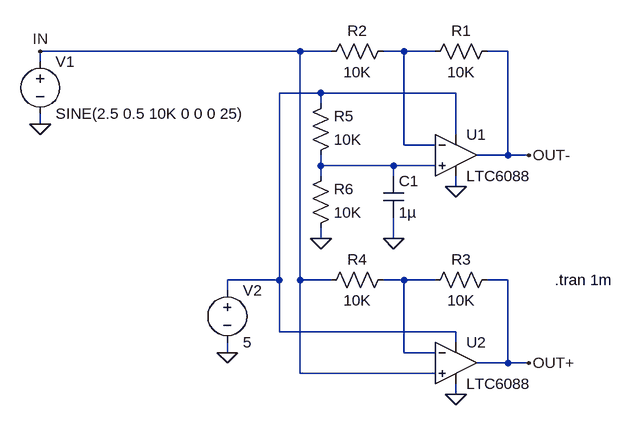
[diagram p0: schematic 6088.asc]
6088.asc, the LTspice schematic file:
Version 4
SHEET 1 912 700
WIRE -112 -880 -512 -880
WIRE -64 -880 -112 -880
WIRE 48 -880 16 -880
WIRE 96 -880 48 -880
WIRE 208 -880 176 -880
WIRE -512 -864 -512 -880
WIRE -80 -816 -144 -816
WIRE 128 -816 -80 -816
WIRE -80 -800 -80 -816
WIRE -512 -768 -512 -784
WIRE 128 -752 128 -816
WIRE 48 -736 48 -880
WIRE 96 -736 48 -736
WIRE 208 -720 208 -880
WIRE 208 -720 160 -720
WIRE 240 -720 208 -720
WIRE -80 -704 -80 -720
WIRE 32 -704 -80 -704
WIRE 96 -704 32 -704
WIRE -80 -688 -80 -704
WIRE 32 -688 32 -704
WIRE 128 -672 128 -688
WIRE -80 -592 -80 -608
WIRE 32 -592 32 -624
WIRE -144 -528 -144 -816
WIRE -144 -528 -224 -528
WIRE -112 -528 -112 -880
WIRE -64 -528 -112 -528
WIRE 48 -528 16 -528
WIRE 96 -528 48 -528
WIRE 208 -528 176 -528
WIRE -224 -512 -224 -528
WIRE -144 -448 -144 -528
WIRE 128 -448 -144 -448
WIRE 128 -432 128 -448
WIRE -224 -416 -224 -432
WIRE 48 -416 48 -528
WIRE 96 -416 48 -416
WIRE 208 -400 208 -528
WIRE 208 -400 160 -400
WIRE 240 -400 208 -400
WIRE -112 -384 -112 -528
WIRE 96 -384 -112 -384
WIRE 128 -352 128 -368
FLAG -512 -768 0
FLAG -512 -880 IN
FLAG 240 -720 OUT-
FLAG 240 -400 OUT+
FLAG -224 -416 0
FLAG 128 -672 0
FLAG 128 -352 0
FLAG 32 -592 0
FLAG -80 -592 0
SYMBOL voltage -512 -880 R0
WINDOW 123 24 146 Left 2
WINDOW 39 24 125 Left 2
SYMATTR InstName V1
SYMATTR Value SINE(2.5 0.5 10K 0 0 0 25)
SYMBOL voltage -224 -528 R0
SYMATTR InstName V2
SYMATTR Value 5
SYMBOL res 192 -896 R90
WINDOW 0 0 56 VBottom 2
WINDOW 3 32 56 VTop 2
SYMATTR InstName R1
SYMATTR Value 10K
SYMBOL res 32 -896 R90
WINDOW 0 0 56 VBottom 2
WINDOW 3 32 56 VTop 2
SYMATTR InstName R2
SYMATTR Value 10K
SYMBOL LTC6088 128 -720 R0
SYMATTR InstName U1
SYMBOL res 192 -544 R90
WINDOW 0 0 56 VBottom 2
WINDOW 3 32 56 VTop 2
SYMATTR InstName R3
SYMATTR Value 10K
SYMBOL res 32 -544 R90
WINDOW 0 0 56 VBottom 2
WINDOW 3 32 56 VTop 2
SYMATTR InstName R4
SYMATTR Value 10K
SYMBOL LTC6088 128 -400 R0
SYMATTR InstName U2
SYMBOL res -96 -704 M180
WINDOW 0 36 76 Left 2
WINDOW 3 36 40 Left 2
SYMATTR InstName R5
SYMATTR Value 10K
SYMBOL res -96 -592 M180
WINDOW 0 36 76 Left 2
WINDOW 3 36 40 Left 2
SYMATTR InstName R6
SYMATTR Value 10K
SYMBOL cap 16 -688 R0
SYMATTR InstName C1
SYMATTR Value 1µ
TEXT 280 -528 Left 2 !.tran 1m

The netlist it stands for:
* 6088.asc
V1 IN 0 SINE(2.5 0.5 10K 0 0 0 25)
V2 N002 0 5
R1 OUT- N001 10K
R2 N001 IN 10K
* U1: LTC6088 (symbol LTC6088 not available, pins judged from their places): In+=N003 In-=N001 V+=N002 V-=0 OUT=OUT-
R3 OUT+ N004 10K
R4 N004 IN 10K
* U2: LTC6088 (symbol LTC6088 not available, pins judged from their places): In+=IN In-=N004 V+=N002 V-=0 OUT=OUT+
R5 N003 N002 10K
R6 0 N003 10K
C1 N003 0 1µ
.tran 1m
.backanno
.end